# EasyEDA Pro project USB-HUB-2.0.epro

# Schematic Schematic1
Board Name: Board2; Create Date: 2025-09-10; Page Name: P1; Project Name: USB扩展坞2.0; Schematic Name: Schematic2; Update Date: 2025-09-11; Company: 嘉立创EDA; Page Size: A4; Version: V1.0
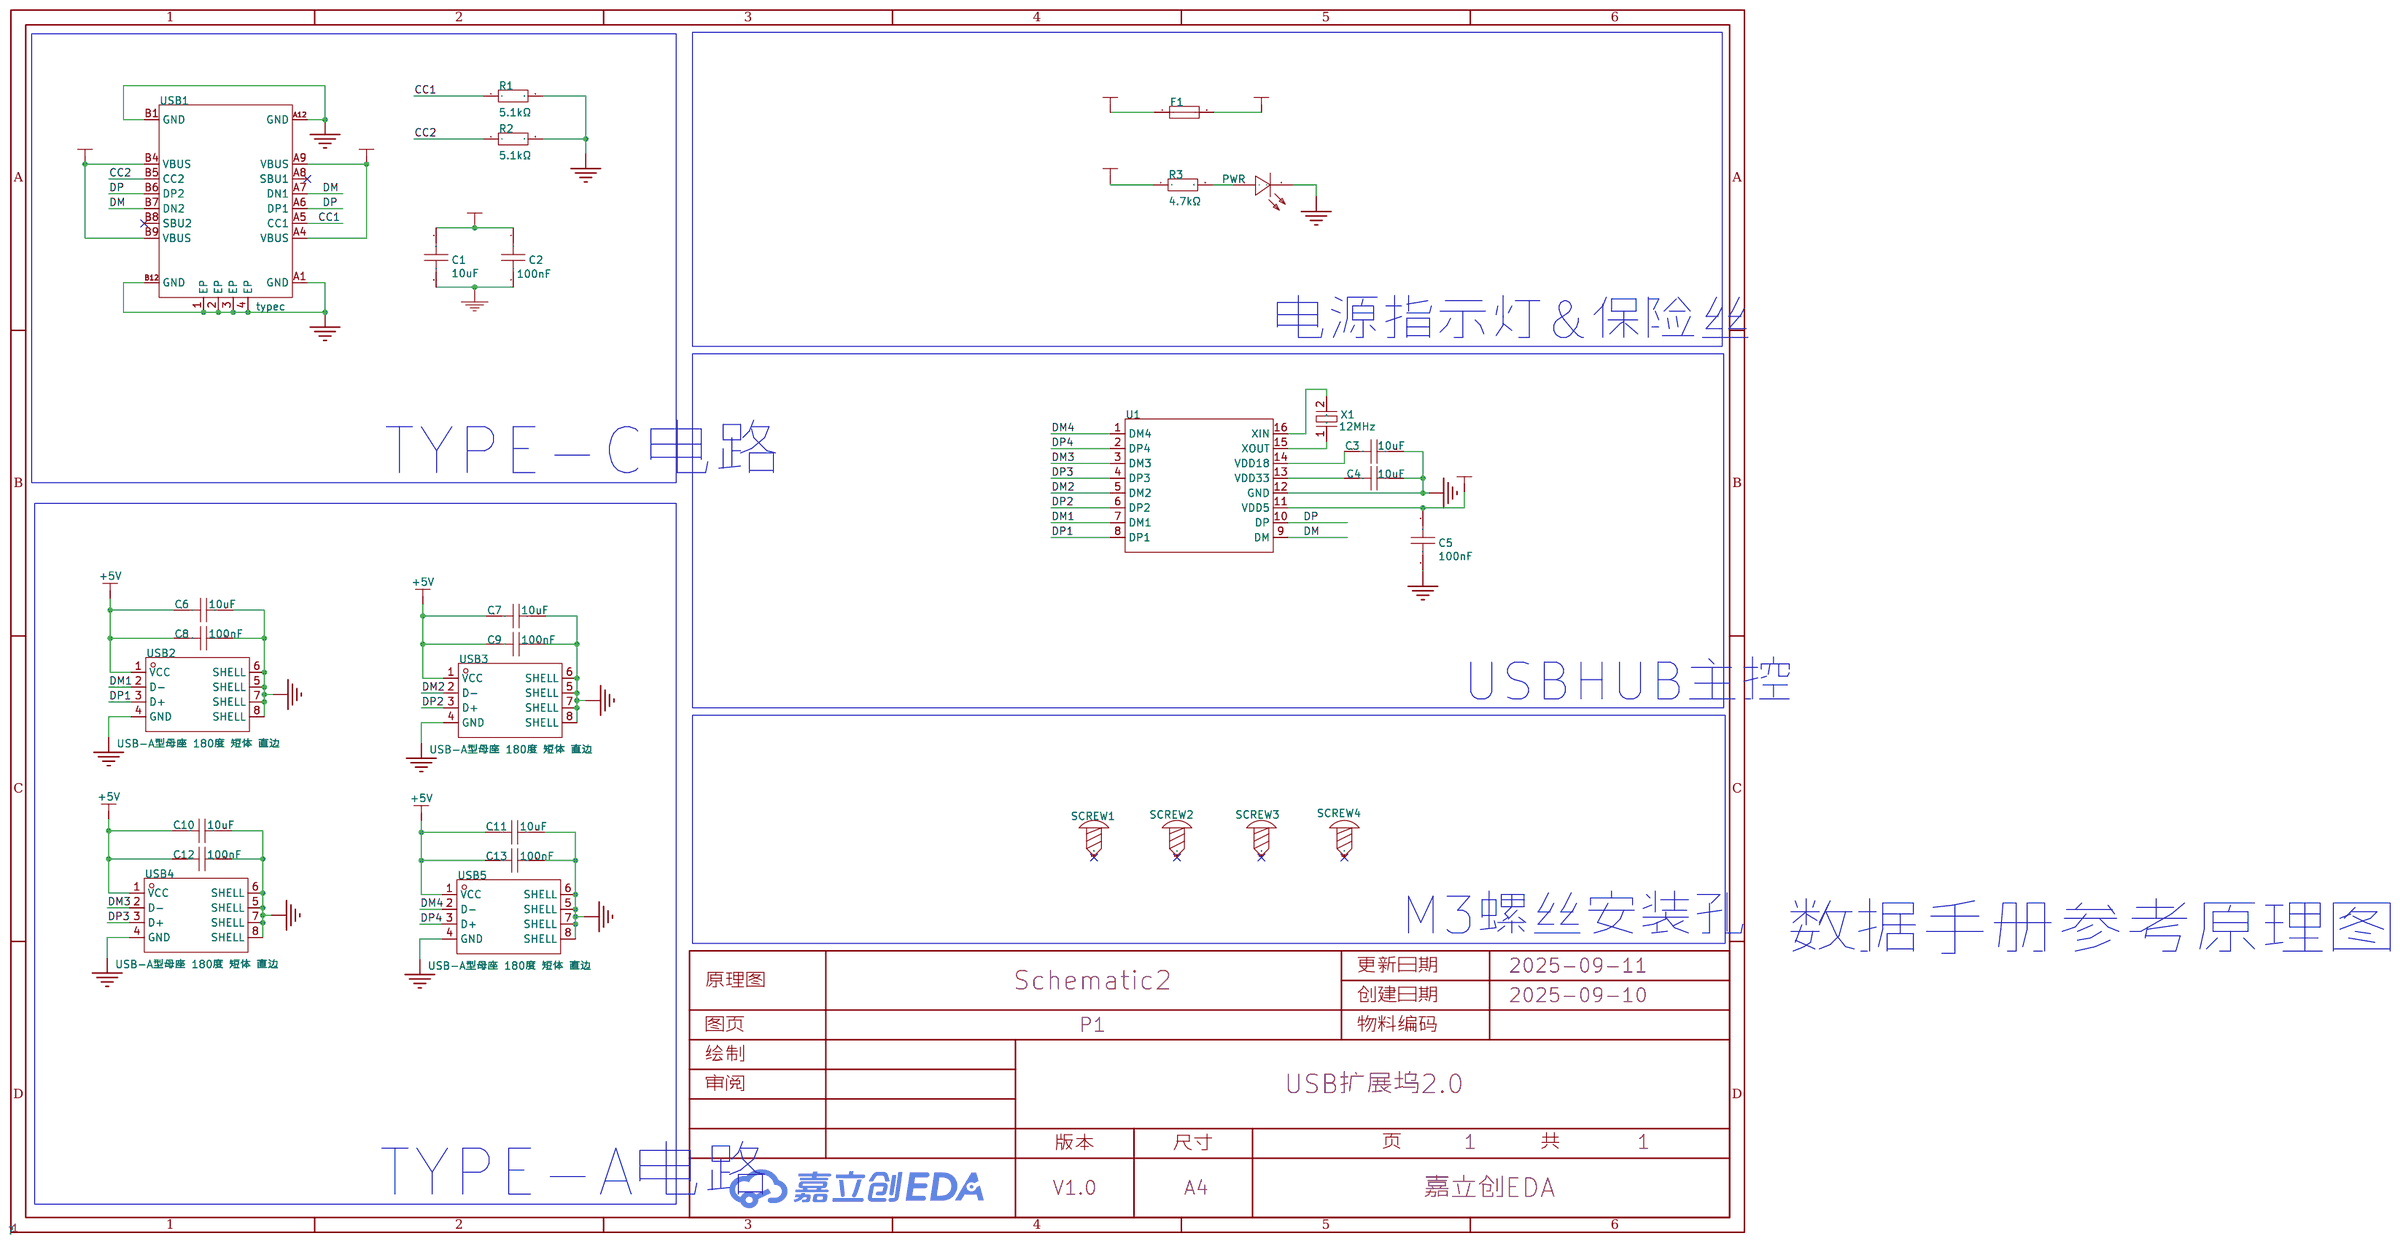
[diagram p0: schematic sheet]

## Parts
C1  10uF  [C0805]
C2  100nF  [C0805]
C3  10uF  [C0805]
C4  10uF  [C0805]
C5  100nF  [C0805]
C6  10uF  [C0805]
C7  10uF  [C0805]
C8  100nF  [C0805]
C9  100nF  [C0805]
C10  10uF  [C0805]
C11  10uF  [C0805]
C12  100nF  [C0805]
C13  100nF  [C0805]
F1  BSMD1206-150-12V  [F1206]
PWR  NCD0805R1  [LED0805-R-RD]
R1  5.1kΩ  [R0805]
R2  5.1kΩ  [R0805]
R3  4.7kΩ  [R0805]
SCREW1  -  [M3螺丝]
SCREW2  -  [M3螺丝]
SCREW3  -  [M3螺丝]
SCREW4  -  [M3螺丝]
U1  SL2.1A  [SOP-16_L10.0-W3.9-P1.27-LS6.0-BL]
USB1  typec  [USB-C-SMD_KH-TYPE-C-16P]
USB2  USB-A型母座 180度 短体 直边  [USB-A-SMD_WT_C9900004571]
USB3  USB-A型母座 180度 短体 直边  [USB-A-SMD_WT_C9900004571]
USB4  USB-A型母座 180度 短体 直边  [USB-A-SMD_WT_C9900004571]
USB5  USB-A型母座 180度 短体 直边  [USB-A-SMD_WT_C9900004571]
X1  12MHz  [CRYSTAL-SMD_L5.0-W3.2-1]

## Library data of the parts
C1 C6 C7 C10 C11 = CL21A106KOQNNNE: 容值:10uF;精度:±10%;额定电压:16V;温度系数:X5R;; LCSC Part Name: 10uF ±10% 16V; Supplier Part: C1713; Manufacturer: SAMSUNG(三星); Supplier Footprint: 0805; JLCPCB Part Class: Extended Part; Datasheet: https://item.szlcsc.com/datasheet/CL21A106KOQNNNE/2065.html; Supplier: LCSC; Tolerance: ±10%; Voltage Rating: 16V; Temperature Coefficient: X5R
C2 C5 C8 C9 C12 C13 = 0805B104K500NT: 容值:100nF;精度:±10%;额定电压:50V;温度系数:X7R;; LCSC Part Name: 100nF ±10% 50V; Supplier Part: C38141; Manufacturer: FH(风华); Supplier Footprint: 0805; JLCPCB Part Class: Extended Part; Datasheet: https://item.szlcsc.com/datasheet/0805B104K500NT/39123.html; Supplier: LCSC; Tolerance: ±10%; Voltage Rating: 50V; Temperature Coefficient: X7R
C3 C4 = CL21A106KBYQNNE: 容值:10uF;精度:±10%;额定电压:50V;温度系数:X5R;; LCSC Part Name: 10uF ±10% 50V; Supplier Part: C2932476; Manufacturer: SAMSUNG(三星); Supplier Footprint: 0805; JLCPCB Part Class: 扩展库; Datasheet: https://item.szlcsc.com/datasheet/CL21A106KBYQNNE/3277789.html; Supplier: LCSC; Tolerance: ±10%; Voltage Rating: 50V; Temperature Coefficient: X5R
F1 = BSMD1206-150-12V: 耐压(Vmax):12V;最大电流(Imax):40A;保持电流(Ihold):1.5A;跳闸电流(Itrip):3A;; LCSC Part Name: 12V 1.5A 1206自恢复; Supplier Part: C3020147; Manufacturer: BHFUSE(佰宏); Supplier Footprint: 1206; JLCPCB Part Class: 扩展库; Datasheet: https://item.szlcsc.com/datasheet/BSMD1206-150-12V/3539855.html; Supplier: LCSC; Voltage - Max: 12V; Current - Max: 40A; Hold Current: 1.5A; Trip Current: 3A; Power Dissipation: 800mW; Resistance - Initial (Ri) (Min): 25mΩ; Resistance - Post Trip (R1) (Max): 130mΩ; Operating Temperature: -40℃~+85℃
PWR = NCD0805R1: 灯头类型:-;发光颜色:红色;正向电压(VF):1.6V~2.6V;功率:65mW;正向电流:20mA;主波长:615nm~630nm;二极管配置:独立二极管;透镜颜色:无色透明透镜;色温:-;发光强度:67mcd~195mcd;发光角度:130°;载带方式:-;工作温度:-30℃~+85℃;; Supplier Part: C84256; Manufacturer: 国星光电; Supplier Footprint: 0805; JLCPCB Part Class: 基础库; Datasheet: https://atta.szlcsc.com/upload/public/pdf/source/20200820/C84256_F0A75A43B3EAD75808600A0514C76B99.pdf; Supplier: LCSC; Emitted Color: 红色; Forward Voltage (VF): 1.6V~2.6V; Power Dissipation: 65mW; Forward Current: 20mA; Dominant Wavelength: 615nm~630nm; Diode Configuration: 独立二极管; Lens Color: 无色透明透镜; Luminous Intensity: 67mcd~195mcd; Viewing Angle: 130°; Operating Temperature: -30℃~+85℃
R1 R2 = 0805W8F5101T5E: 电阻类型:厚膜电阻;阻值:5.1kΩ;精度:±1%;功率:125mW;工作电压:150V;温度系数:±100ppm/℃;; LCSC Part Name: 5.1kΩ ±1% 125mW 厚膜电阻; Supplier Part: C27834; Manufacturer: UNI-ROYAL(厚声); Supplier Footprint: 0805; JLCPCB Part Class: 基础库; Datasheet: https://item.szlcsc.com/datasheet/0805W8F5101T5E/28584.html; Supplier: LCSC; Type: 厚膜电阻; Tolerance: ±1%; Power(Watts): 125mW; Voltage-Supply(Max): 150V; Temperature Coefficient: ±100ppm/℃; Operating Temperature: -55℃~+155℃
R3 = 0805W8F4701T5E: 电阻类型:厚膜电阻;阻值:4.7kΩ;精度:±1%;功率:125mW;最大工作电压:150V;温度系数:±100ppm/℃;; LCSC Part Name: 4.7kΩ ±1% 125mW 厚膜电阻; Supplier Part: C17673; Manufacturer: UNI-ROYAL(厚声); Supplier Footprint: 0805; JLCPCB Part Class: 基础库; Datasheet: https://atta.szlcsc.com/upload/public/pdf/source/20200306/C422600_1E6D84923E4A46A82E41ADD87F860B5C.pdf; Supplier: LCSC; Type: 厚膜电阻; Tolerance: ±1%; Power(Watts): 125mW; Overload Voltage (Max): 150V; Temperature Coefficient: ±100ppm/℃; Operating Temperature Range: -55℃~+155℃
SCREW1-SCREW4 = M3螺丝: Supplier Footprint: 插件
U1 = SL2.1A: SL2.1A是一颗高集成度,高性能,低功耗的USB2.0集线器主控芯片，支持USB2.0高速(480MHz),全速(12MHz)和低速模式(1.5MHz)，内置12MHz晶体振荡器。; LCSC Part Name: USB2.0高速4端口HUB控制器; Supplier Part: C192893; Manufacturer: CoreChips(和芯润德); Supplier Footprint: SOP-16; JLCPCB Part Class: Extended Part; Datasheet: https://atta.szlcsc.com/upload/public/pdf/source/20180522/C192893_624110D24898D57AAC785E3DF98EA862.pdf; Supplier: LCSC
USB1 = typec: Supplier Part: C9900016956; Supplier Footprint: typec 12p; JLCPCB Part Class: 扩展库; Supplier: LCSC
USB2-USB5 = USB-A型母座 180度 短体 直边: Supplier Part: C9900004571; Supplier Footprint: SMD; JLCPCB Part Class: 扩展库; Supplier: LCSC
X1 = HY12MSMD5032TCOB1R10: 频率:12MHz;负载电容:20pF;频率稳定度:±10ppm;; LCSC Part Name: 12MHz 20pF; Supplier Part: C7275156; Manufacturer: Huiyuan crystal(惠源晶工); Supplier Footprint: SMD5032-2P; JLCPCB Part Class: 扩展库; Datasheet: https://item.szlcsc.com/datasheet/HY12MSMD5032TCOB1R10/8244163.html; Supplier: LCSC; Load Capacitance: 20pF; Frequency Stability: ±10ppm; Equivalent Series Resistance(ESR): 50Ω

## Nets
+5V: C5.1 C6.1 C7.1 C8.1 C9.1 C10.1 C11.1 C12.1 C13.1 F1.2 R3.1 U1.11(VDD5) USB2.1(VCC) USB3.1(VCC) USB4.1(VCC) USB5.1(VCC)
GND: C1.2 C2.2 C3.2 C4.2 C5.2 C6.2 C7.2 C8.2 C9.2 C10.2 C11.2 C12.2 C13.2 PWR.2(-) R1.2 R2.2 U1.12(GND) USB1.1(EP) USB1.2(EP) USB1.3(EP) USB1.4(EP) USB1.A1(GND) USB1.A12(GND) USB1.B1(GND) USB1.B12(GND) USB2.4(GND) USB2.5(SHELL) USB2.6(SHELL) USB2.7(SHELL) USB2.8(SHELL) USB3.4(GND) USB3.5(SHELL) USB3.6(SHELL) USB3.7(SHELL) USB3.8(SHELL) USB4.4(GND) USB4.5(SHELL) USB4.6(SHELL) USB4.7(SHELL) USB4.8(SHELL) USB5.4(GND) USB5.5(SHELL) USB5.6(SHELL) USB5.7(SHELL) USB5.8(SHELL)
VBUS: C1.1 C2.1 F1.1 USB1.A4(VBUS) USB1.A9(VBUS) USB1.B4(VBUS) USB1.B9(VBUS)
CC1: R1.1 USB1.A5(CC1)
CC2: R2.1 USB1.B5(CC2)
DM: U1.9(DM) USB1.A7(DN1) USB1.B7(DN2)
DM1: U1.7(DM1) USB2.2(D-)
DM2: U1.5(DM2) USB3.2(D-)
DM3: U1.3(DM3) USB4.2(D-)
DM4: U1.1(DM4) USB5.2(D-)
DP: U1.10(DP) USB1.A6(DP1) USB1.B6(DP2)
DP1: U1.8(DP1) USB2.3(D+)
DP2: U1.6(DP2) USB3.3(D+)
DP3: U1.4(DP3) USB4.3(D+)
DP4: U1.2(DP4) USB5.3(D+)
$1N2176: C4.1 U1.13(VDD33)
$1N2182: C3.1 U1.14(VDD18)
$1N5507: U1.16(XIN) X1.2(GND)
$1N5514: U1.15(XOUT) X1.1
$1N7940: PWR.1(+) R3.2

Not connected (* = marked no-connect by the designer): SCREW1 1*; SCREW2 1*; SCREW3 1*; SCREW4 1*; USB1 A8(SBU1)* B8(SBU2)*

## Notes on the sheet
- 电源指示灯&保险丝
- TYPE-C电路
- USBHUB主控
- M3螺丝安装孔
- 数据手册参考原理图
- TYPE-A电路

# Board PCB1
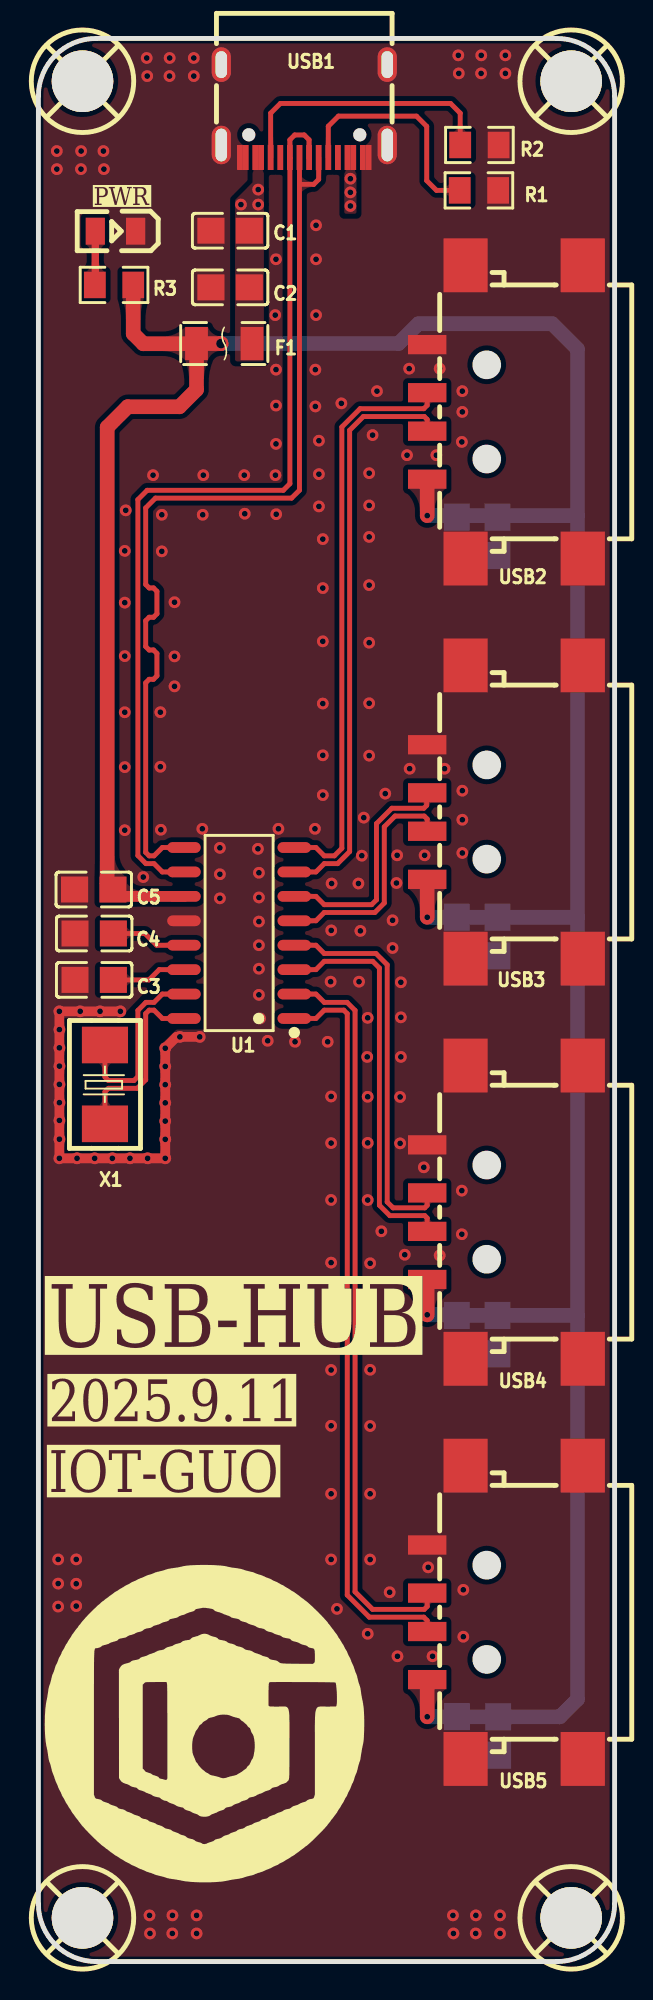
[diagram p1: board, top side]
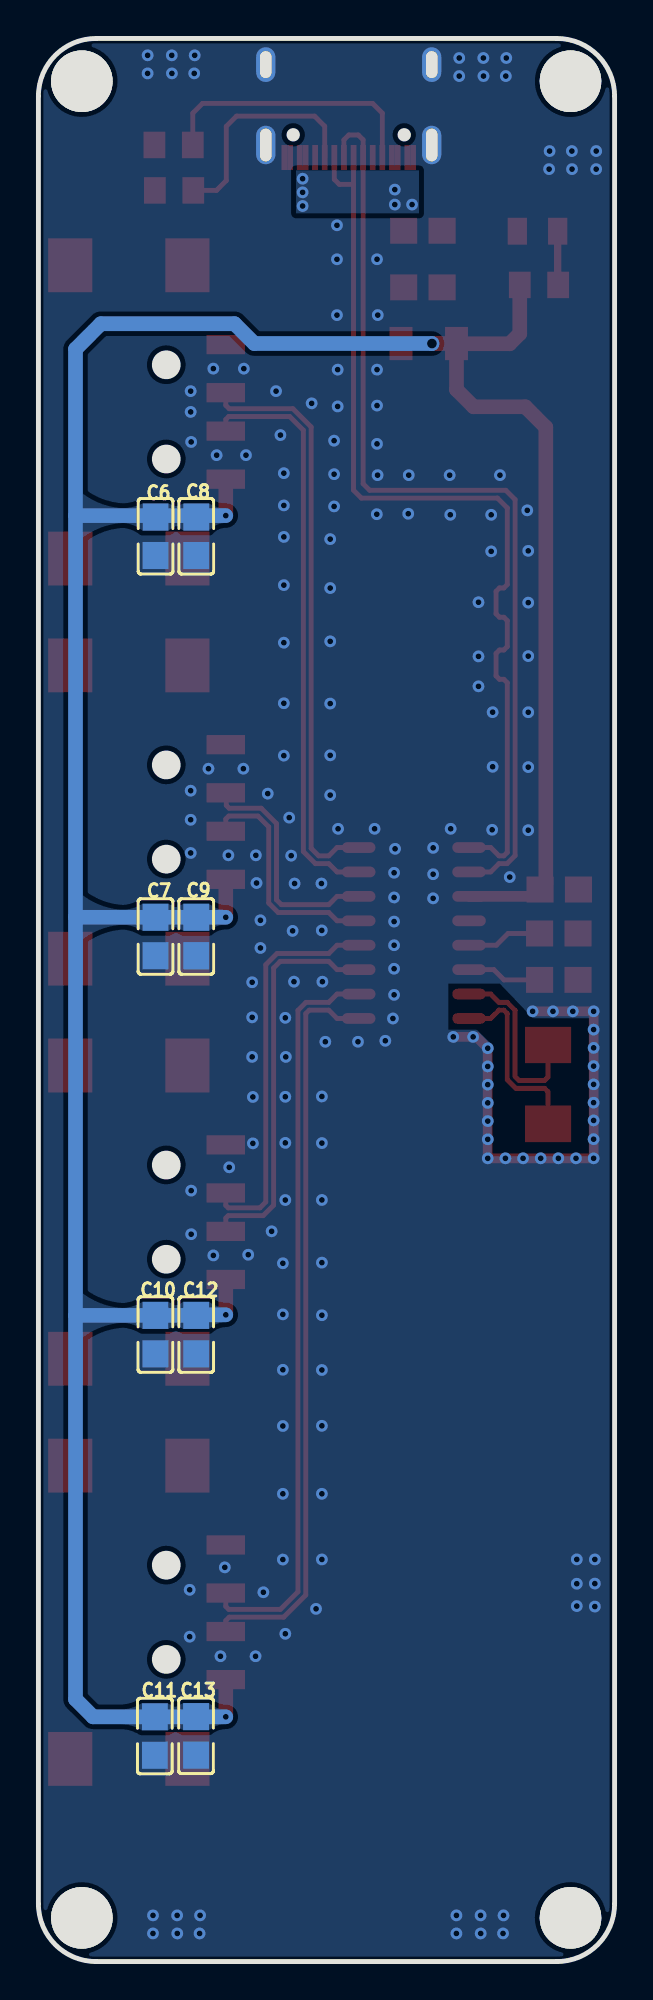
[diagram p2: board, bottom side, seen from below]

Outline 30 x 100 mm; copper layers: Top Layer, Bottom Layer. Coordinates in mm from the lower left corner of the outline.
Outline path: 0,97 0,3 arc(0.88,0.88) 3,0 27,0 arc(29.12,0.88) 30,3 30,97 arc(29.12,99.12) 27,100 3,100 arc(0.88,99.12) 0,97
Stack: Top Layer 0.035mm / Dielectric1 1.51mm FR4 er 4.5 / Bottom Layer 0.035mm

## Design rules (mm)
net DM4: DP5
net DP4: DP5
net DM3: DP4
net DP3: DP4
net DM2: DP2
net DP2: DP2
net DM1: DP3
net DP1: DP3
net $1N5507: DP1
net $1N5514: DP1
net DP: DP6
net DM: DP6
template: 自定义配置
spacing copperThickness1oz (default): track to track 0.102, other pairs 0.152 to 0.3
spacing copperThickness2oz: track to track 0.203, other pairs 0.152 to 0.3
track width copperThickness1oz (default): min 0.127, default 0.254, max 2.54
track width copperThickness2oz: min 0.203, default 0.254, max 2.54
differential pair differentialPair (default): width min 0.127, default 0.254, max 2.54; gap min 0.152, default 0.152
via viaSize (default): diameter min 0.5, default 0.61, max 10; hole min 0.3, default 0.305, max 6.3

## Placement (name value [footprint] x y rotation side)
C1  10uF  [C0805]  9.98 90 180 top
C2  100nF  [C0805]  9.98 87.06 180 top
C3  10uF  [C0805]  2.9 51.05 180 top
C4  10uF  [C0805]  2.9 53.46 180 top
C5  100nF  [C0805]  2.88 55.74 180 top
C6  10uF  [C0805]  23.9 74.11 270 bottom
C7  10uF  [C0805]  23.9 53.3 270 bottom
C8  100nF  [C0805]  21.78 74.11 270 bottom
C9  100nF  [C0805]  21.78 53.3 270 bottom
C10  10uF  [C0805]  23.91 32.6 270 bottom
C11  10uF  [C0805]  23.94 11.73 270 bottom
C12  100nF  [C0805]  21.78 32.6 270 bottom
C13  100nF  [C0805]  21.79 11.74 270 bottom
F1  BSMD1206-150-12V  [F1206]  9.68 84.14 180 top
PWR  NCD0805R1  [LED0805-R-RD]  4.01 89.98 180 top
R1  5.1kΩ  [R0805]  22.94 92.1 0 top
R2  5.1kΩ  [R0805]  22.96 94.46 0 top
R3  4.7kΩ  [R0805]  3.94 87.18 180 top
SCREW1  -  [M3螺丝]  2.3 2.27 0 top
SCREW2  -  [M3螺丝]  27.74 2.27 0 top
SCREW3  -  [M3螺丝]  2.3 97.78 0 top
SCREW4  -  [M3螺丝]  27.74 97.78 0 top
U1  SL2.1A  [SOP-16_L10.0-W3.9-P1.27-LS6.0-BL]  10.45 53.48 90 top
USB1  typec  [USB-C-SMD_KH-TYPE-C-16P]  13.84 96.23 180 top
USB2  USB-A型母座 180度 短体 直边  [USB-A-SMD_WT_C9900004571]  24.29 80.58 90 top
USB3  USB-A型母座 180度 短体 直边  [USB-A-SMD_WT_C9900004571]  24.29 59.77 90 top
USB4  USB-A型母座 180度 短体 直边  [USB-A-SMD_WT_C9900004571]  24.29 38.97 90 top
USB5  USB-A型母座 180度 短体 直边  [USB-A-SMD_WT_C9900004571]  24.29 18.16 90 top
X1  12MHz  [CRYSTAL-SMD_L5.0-W3.2-1]  3.47 45.61 270 top

## Footprints (pads in the part's own frame, mm; a bottom-side part is the same pattern mirrored in y, then rotated)
C0805
  rect 1.41x1.35 smd: 1(-1,0) 2(1,0)
CRYSTAL-SMD_L5.0-W3.2-1
  rect 1.9x2.4 smd: 1(-2.05,0) 2(2.05,0)
F1206
  rect 1.19x1.728 smd: 1(-1.445,0) 2(1.445,0)
LED0805-R-RD
  rect 1x1.399 smd: 1(1.05,0) 2(-1.05,0)
M3螺丝
  round 3.2 hole 3.2: 1(0,0)
R0805
  rect 1.133x1.377 smd: 1(-1,0) 2(1,0)
SOP-16_L10.0-W3.9-P1.27-LS6.0-BL
  oval 0.56x1.745 smd: 1(-4.445,-2.873) 2(-3.175,-2.873) 3(-1.905,-2.873) 4(-0.635,-2.873) 5(0.635,-2.873) 6(1.905,-2.873) 7(3.175,-2.873) 8(4.445,-2.873) 9(4.445,2.873) 10(3.175,2.873) 11(1.905,2.873) 12(0.635,2.873) 13(-0.635,2.873) 14(-1.905,2.873) 15(-3.175,2.873) 16(-4.445,2.873)
USB-A-SMD_WT_C9900004571
  rect 1x2 smd: 1(-3.5,4.05) 2(-1,4.05) 3(1,4.05) 4(3.5,4.05)
  rect 2.8x2.3 smd: 5(-7.625,2.05) 6(-7.625,-4.05) 7(7.625,-4.05) 8(7.625,2.05)
USB-C-SMD_KH-TYPE-C-16P
  oval 1x2 hole 0.6x1.7: 1(-4.32,1.765) 2(4.32,1.765)
  oval 1x1.8 hole 0.6x1.4: 3(-4.32,-2.415) 4(4.32,-2.415)
  rect 0.3x1.3 smd: A1(-3.35,2.415) A4(-2.55,2.415) A5(-1.25,2.415) A6(-0.25,2.415) A7(0.25,2.415) A8(1.25,2.415) A9(2.55,2.415) A12(3.35,2.415) B1(3.05,2.415) B4(2.25,2.415) B5(1.75,2.415) B6(0.75,2.415) B7(-0.75,2.415) B8(-1.75,2.415) B9(-2.25,2.415) B12(-3.05,2.415)

## Nets
As in the schematic.

Pads without a net: SCREW1 1; SCREW2 1; SCREW3 1; SCREW4 1; USB1 A8 B8

## Via types
v1: diameter 0.61, hole 0.305, Top Layer to Bottom Layer, 206 vias
v2: diameter 0.762, hole 0.508, Top Layer to Bottom Layer, 1 via

## Routing (per net, layer and track width the routed paths; a pad name or vN(x,y) marks a point on that pad's centre or on a via; arc(x,y) is an arc through that point)
+5V: length 172.2
  Top Layer w0.559: U1.11 4.17,55.39 3.93,55.63 ; 3.88,55.63 C5.1
  Top Layer w0.762: 8.23,84 8.23,81.74 7.34,80.85 4.65,80.85 3.58,79.78 3.58,56.04 C5.1 ; v1(20.24,75.19) USB2.1 ; v1(20.24,33.63) USB4.1 ; v1(20.24,54.3) USB3.1 ; v1(20.24,12.73) USB5.1 ; R3.1 4.94,84.65 5.46,84.12 8.24,84.12 F1.2 v2(9.51,84.14)
  Bottom Layer w0.762: 28.07,54.32 28.07,33.59 ; 28.07,54.32 28.07,83.85 26.75,85.17 19.79,85.17 18.76,84.14 v2(9.51,84.14) ; 28.07,54.32 28.05,54.3 C7.1 C9.1 v1(20.24,54.3) ; 28.07,33.59 28.07,13.64 27.15,12.73 23.94,12.73 ; 28.07,33.59 28.05,33.6 C12.1 21.76,33.63 v1(20.24,33.63) ; v1(20.24,75.19) 28.07,75.19 ; C11.1 v1(20.24,12.73)
GND: length 24.1
  Top Layer w0.508: v1(4.27,49.41) v1(3.21,49.41) v1(2.18,49.41) v1(1.09,49.41) 1.09,41.77 ; v1(8.4,48.08) 7.19,48.08 v1(6.6,47.49) v1(6.6,46.55) v1(6.6,45.6) v1(6.6,44.65) v1(6.6,43.7) v1(6.6,42.76) v1(6.6,41.77) v1(5.69,41.77) v1(4.77,41.77) v1(3.85,41.77) v1(2.93,41.77) v1(2.01,41.77) v1(1.09,41.77)
  vias: v1(0.96,94.14) v1(0.96,93.21) v1(1.03,20.91) v1(1.03,19.65) v1(1.03,18.46) v1(1.09,48.46) v1(1.09,47.51) v1(1.09,46.56) v1(1.09,45.61) v1(1.09,44.66) v1(1.09,43.74) v1(1.09,42.76) v1(1.97,20.91) v1(1.97,19.65) v1(1.97,18.48) v1(2.22,94.14) v1(2.22,93.21) v1(3.38,94.14) v1(3.41,93.21) v1(4.55,75.46) v1(4.5,73.36) v1(4.5,70.66) v1(4.5,67.88) v1(4.5,64.96) v1(4.5,62.11) v1(4.5,58.83) v1(5.46,56.39) v1(5.64,98.98) v1(5.66,98.04) v1(5.78,2.4) v1(5.81,1.46) v1(5.97,77.29) v1(6.35,64.97) v1(6.35,62.13) v1(6.43,75.23) v1(6.43,73.33) v1(6.38,58.85) v1(6.83,98.98) v1(6.83,98.04) v1(6.98,2.4) v1(6.97,1.46) v1(7.09,70.68) v1(7.09,67.87) v1(7.09,66.31) v1(7.37,48.08) v1(8.09,98.98) v1(8.09,98.04) v1(8.24,2.4) v1(8.24,1.46) v1(8.53,58.9) v1(8.59,77.29) v1(8.56,75.23) v1(9.45,57.91) v1(9.45,56.54) v1(9.45,55.29) v1(10.72,77.29) v1(10.74,75.29) v1(11.43,57.86) v1(11.48,56.62) v1(11.48,55.33) v1(11.48,54.08) v1(11.48,52.85) v1(11.48,51.63) v1(11.48,50.27) v1(11.54,49.04) v1(11.94,47.88) v1(12.33,85.61) v1(12.34,77.29) v1(12.37,88.52) v1(12.37,82.78) v1(12.37,80.91) v1(12.37,78.92) v1(12.38,75.26) v1(12.5,58.9) v1(13.36,47.83) v1(14.42,82.78) v1(14.42,80.87) v1(14.4,58.9) v1(14.46,90.28) v1(14.46,88.52) v1(14.46,85.61) v1(14.6,79.08) v1(14.6,77.34) v1(14.6,75.67) v1(14.81,73.97) v1(14.81,71.42) v1(14.81,68.65) v1(14.81,65.42) v1(14.81,62.72) v1(14.81,60.66) v1(15.06,47.83) v1(15.25,53.62) v1(15.21,50.95) v1(15.24,44.98) v1(15.24,42.56) v1(15.24,39.6) v1(15.24,36.34) v1(15.24,33.61) v1(15.24,30.76) v1(15.24,27.86) v1(15.24,24.32) v1(15.24,20.91) v1(15.27,56.06) v1(15.54,18.34) v1(15.77,81.03) v1(16.66,56.06) v1(16.69,50.95) v1(16.84,57.51) v1(16.76,53.59) v1(16.94,59.48) v1(17.15,49.07) v1(17.12,47.04) v1(17.15,44.97) v1(17.15,42.57) v1(17.15,39.6) v1(17.15,17.04) v1(17.22,77.39) v1(17.22,75.72) v1(17.22,74.08) v1(17.22,71.57) v1(17.22,68.58) v1(17.22,65.43) v1(17.22,62.71) v1(17.27,36.31) v1(17.27,33.65) v1(17.27,30.77) v1(17.27,27.85) v1(17.27,24.32) v1(17.27,20.9) v1(17.4,79.38) v1(17.63,81.66) v1(17.86,37.97) v1(18.06,60.73) v1(18.29,19.2) v1(18.44,54.15) v1(18.44,52.7) v1(18.64,56.08) v1(18.68,57.52) v1(18.69,15.88) v1(18.83,44.96) v1(18.83,42.55) v1(18.87,50.92) v1(18.87,49.1) v1(18.87,47.04) v1(19.08,36.75) v1(19.19,78.33) v1(19.3,82.83) v1(19.33,62.03) v1(20.11,57.52) v1(20.07,41.3) v1(20.29,20.5) v1(20.52,15.88) v1(20.72,78.33) v1(20.89,82.83) v1(20.89,36.72) v1(21.15,62.03) v1(21.58,2.4) v1(21.61,1.46) v1(21.86,99.12) v1(21.89,98.18) v1(22.05,79.02) v1(22.05,40.09) v1(22.05,37.82) v1(22.07,81.66) v1(22.07,80.58) v1(22.07,60.88) v1(22.07,59.37) v1(22.07,57.64) v1(22.12,19.33) v1(22.12,16.89) v1(22.78,2.4) v1(22.77,1.46) v1(23.05,98.18) v1(23.06,99.12) v1(24.03,2.4) v1(24.04,1.46) v1(24.31,99.12) v1(24.31,98.18)
VBUS:
  vias: v1(10.55,91.36) v1(11.44,92.14) v1(11.44,91.36) v1(16.24,92.71) v1(16.24,92) v1(16.24,91.29)
CC1: length 11.9
  Top Layer w0.254: USB1.A5 15.09,95.43 15.62,95.96 19.69,95.96 20.22,95.43 20.22,92.61 20.73,92.1 R1.1
CC2: length 14.2
  Top Layer w0.254: R2.1 21.96,96.12 21.46,96.62 12.6,96.62 12.09,96.12 USB1.B5
DM: length 49.5
  Top Layer w0.254: 14.59,93.79 14.59,92.67 14.33,92.41 13.59,92.41 ; 13.59,92.41 13.59,76.51 13.18,76.1 6.1,76.1 5.59,75.59 5.59,71.61 5.77,71.43 5.99,71.43 6.17,71.25 6.17,70.08 5.99,69.9 5.77,69.9 5.59,69.72 5.59,68.38 5.77,68.2 5.99,68.2 6.17,68.02 6.17,66.86 5.99,66.68 5.77,66.68 5.59,66.5 5.59,57.68 5.77,57.5 6.02,57.5 6.45,57.93 U1.9 ; 13.59,92.41 13.59,93.79
DM1: length 30.2
  Top Layer w0.254: 13.32,56.66 14.45,56.66 14.88,57.09 15.58,57.09 16.21,57.72 16.21,79.63 16.92,80.34 20.09,80.34 20.24,80.19 USB2.2
DM2: length 12.2
  Top Layer w0.254: U1.5 14.45,54.12 14.88,54.55 17.52,54.55 18.01,55.04 18.01,59 18.57,59.56 20.09,59.56 20.24,59.41 USB3.2
DM3: length 20.5
  Top Layer w0.254: U1.3 14.45,51.58 14.88,52.01 17.41,52.01 17.75,51.66 17.75,39.33 18.3,38.79 20.12,38.79 20.24,38.66 USB4.2
DM4: length 38.5
  Top Layer w0.254: USB5.2 20.24,17.73 20.07,17.91 17.23,17.91 16.08,19.06 16.08,49.29 15.9,49.47 14.88,49.47 14.45,49.04 13.32,49.04
DP: length 49.6
  Top Layer w0.254: 7.58,56.66 6.45,56.66 6.02,57.09 5.6,57.09 5.18,57.51 5.18,76.02 5.66,76.5 12.75,76.5 13.09,76.85 13.09,94.73 13.35,94.98 13.84,94.98 14.09,94.73 14.09,93.79
DP1: length 30.3
  Top Layer w0.254: U1.8 14.45,57.93 14.88,57.5 15.41,57.5 15.8,57.89 15.8,79.8 16.75,80.75 20.07,80.75 20.24,80.92 USB2.3
DP2: length 12.2
  Top Layer w0.254: USB3.3 20.22,60.77 20.22,60.12 20.07,59.97 18.4,59.97 17.6,59.17 17.6,55.21 17.35,54.96 14.88,54.96 14.45,55.39 U1.6
DP3: length 20.5
  Top Layer w0.254: USB4.3 20.24,39.32 20.12,39.19 18.47,39.19 18.16,39.5 18.16,51.83 17.58,52.42 14.88,52.42 14.45,52.85 U1.4
DP4: length 38.6
  Top Layer w0.254: U1.2 14.45,50.31 14.88,49.88 16.07,49.88 16.49,49.46 16.49,19.23 17.4,18.31 20.09,18.31 20.24,18.47 USB5.3
$1N2176: length 3.9
  Top Layer w0.254: C4.1 5.55,53.46 6.16,52.85 U1.13
$1N2182: length 3.9
  Top Layer w0.254: C3.1 5.76,51.05 6.29,51.58 U1.14
$1N5507: length 9.7
  Top Layer w0.254: X1.2 3.47,45.23 3.65,45.41 5.14,45.41 5.59,45.85 5.59,49.29 5.77,49.47 6.02,49.47 6.45,49.04 7.58,49.04
$1N5514: length 9.7
  Top Layer w0.254: U1.15 6.45,50.31 6.02,49.88 5.6,49.88 5.18,49.46 5.18,46.02 4.98,45.81 3.65,45.81 3.47,45.99 X1.1
$1N7940: length 2.8
  Top Layer w0.381: R3.2 2.96,87.21 2.96,89.98

## Copper pours and planes (outline as drawn; the poured copper is in the pictures)
GND on Top Layer: -3,104.9 37.16,104.9 37.16,-3.63 -3,-3.63
GND on Bottom Layer: -6.93,107.39 39.4,107.39 39.4,-6.73 -6.93,-6.73
VBUS on Top Layer: 11.14,94.46 11.74,94.46 11.74,83.21 10.26,83.21 10.24,83.24 10.24,91.6 11.15,92.52 11.15,94.45
VBUS on Top Layer: 15.93,94.34 16.56,94.34 16.56,90.88 15.93,90.88
VBUS on Bottom Layer: 10.19,93.14 16.59,93.14 16.59,90.91 10.19,90.91

Small or netless copper shapes (teardrops, artwork), in the pictures only: 98 on Top Layer, 19 on Bottom Layer

## Text on the board
Top Silkscreen Layer: 2025.9.11 | IOT-GUO | USB-HUB
